# Altium project Control_Soldering iron.PrjPcb
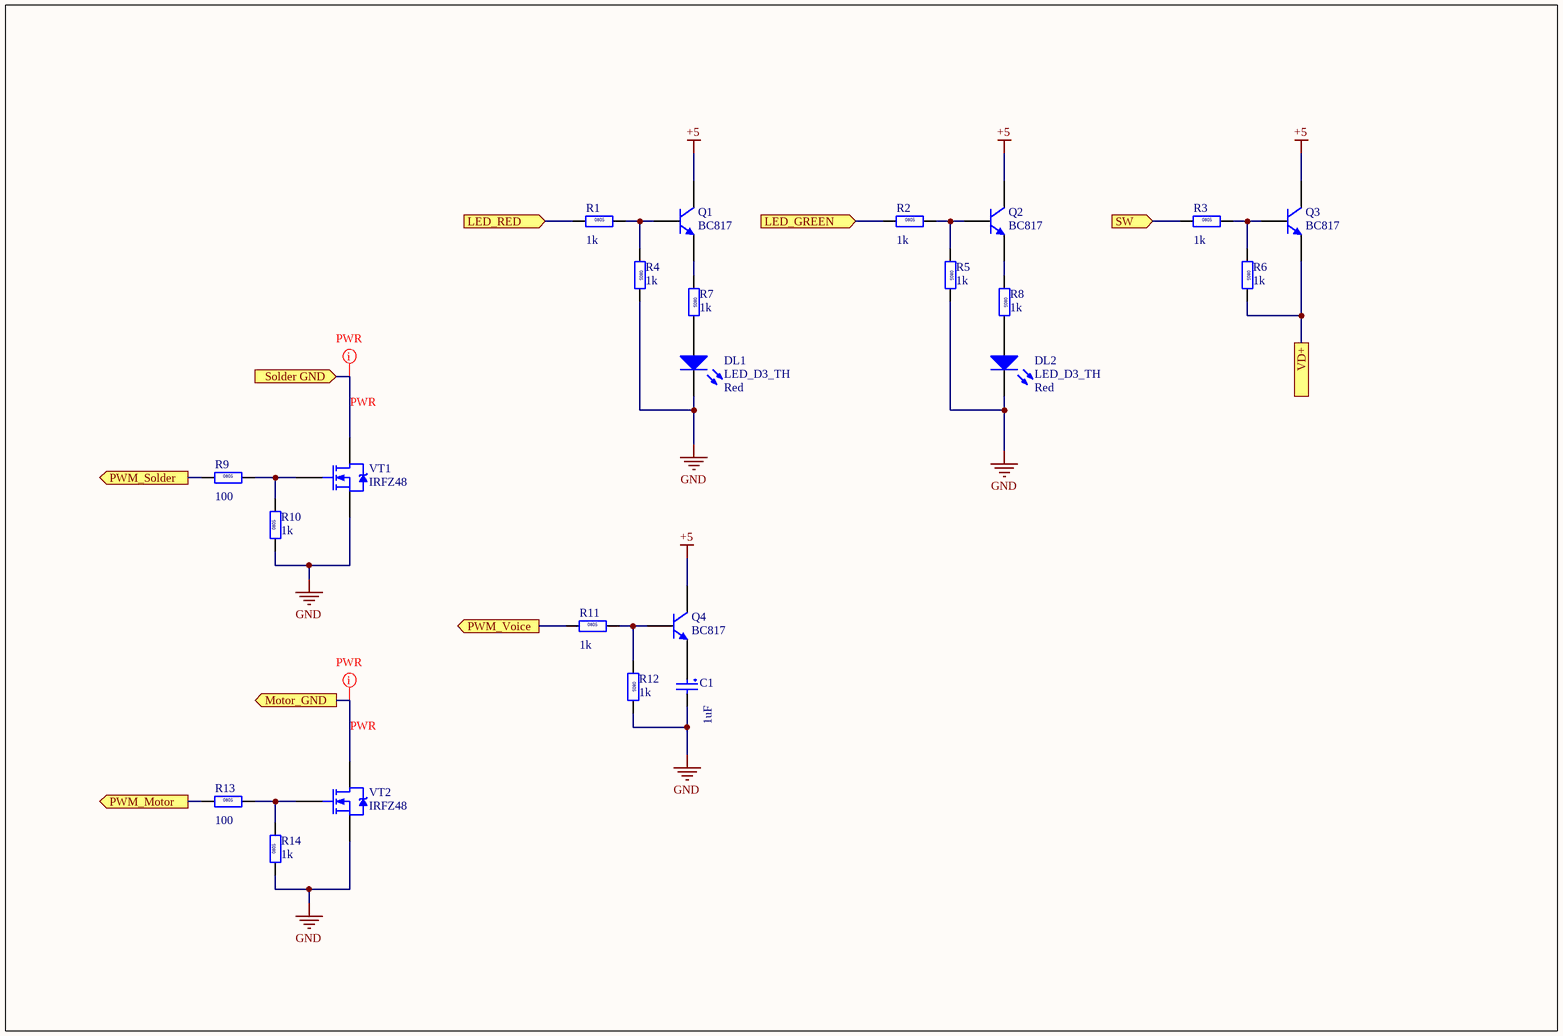
[diagram p0: Led_And_Sound.SchDoc]
2 sheets, 35 parts. Net scope: flat (ports and power ports of the same name join across sheets).
Board file: Soldering_Iron.PcbDoc
Sheets:
  Led_And_Sound.SchDoc
  Amplifier_For_Term.SchDoc

## Sheet Led_And_Sound.SchDoc
size A4

### Parts
C1  value 1uF  [ECAP1325]  (hidden comment: ECAP-1325)
DL1  LED_D3_TH  value Red  [LED_D3_TH]
DL2  LED_D3_TH  value Red  [LED_D3_TH]
Q1  BC817  [SOT23-3M]
Q2  BC817  [SOT23-3M]
Q3  BC817  [SOT23-3M]
Q4  BC817  [SOT23-3M]
R1  value 1k  [RESC2012-0805M]  (hidden comment: RESC_0805_R)
R2  value 1k  [RESC2012-0805M]  (hidden comment: RESC_0805_R)
R3  value 1k  [RESC2012-0805M]  (hidden comment: RESC_0805_R)
R4  value 1k  [RESC2012-0805M]  (hidden comment: RESC_0805_R)
R5  value 1k  [RESC2012-0805M]  (hidden comment: RESC_0805_R)
R6  value 1k  [RESC2012-0805M]  (hidden comment: RESC_0805_R)
R7  value 1k  [RESC2012-0805M]  (hidden comment: RESC_0805_R)
R8  value 1k  [RESC2012-0805M]  (hidden comment: RESC_0805_R)
R9  value 100  [RESC2012-0805M]  (hidden comment: RESC_0805_R)
R10  value 1k  [RESC2012-0805M]  (hidden comment: RESC_0805_R)
R11  value 1k  [RESC2012-0805M]  (hidden comment: RESC_0805_R)
R12  value 1k  [RESC2012-0805M]  (hidden comment: RESC_0805_R)
R13  value 100  [RESC2012-0805M]  (hidden comment: RESC_0805_R)
R14  value 1k  [RESC2012-0805M]  (hidden comment: RESC_0805_R)
VT1  IRFZ48  [TO-220]
VT2  IRFZ48  [TO-220]

### Ports
LED_GREEN (in), LED_RED (in), Motor_GND (out), PWM_Motor (out), PWM_Solder (out), PWM_Voice (out), Solder GND (in), SW (in), VD+

### Nets
+5: Q1.3(C) Q2.3(C) Q3.3(C) Q4.3(C)
GND: C1.2 DL1.2(K) DL2.2(K) R4.2 R5.2 R10.1 R12.2 R14.1 VT1.3(S) VT2.3(S)
NetC1_1: C1.1 Q4.2(E)
NetDL1_1: DL1.1(A) R7.2
NetDL2_1: DL2.1(A) R8.2
NetQ1_1: Q1.1(B) R1.2 R4.1
NetQ1_2: Q1.2(E) R7.1
NetQ2_1: Q2.1(B) R2.2 R5.1
NetQ2_2: Q2.2(E) R8.1
NetQ3_1: Q3.1(B) R3.2 R6.1
NetQ3_2: Q3.2(E) R6.2 ; port VD+
NetQ4_1: Q4.1(B) R11.2 R12.1
NetR1_1: R1.1 ; port LED_RED
NetR2_1: R2.1 ; port LED_GREEN
NetR3_1: R3.1 ; port SW
NetR9_1: R9.1 ; port PWM_Solder
NetR9_2: R9.2 R10.2 VT1.1(G)
NetR11_1: R11.1 ; port PWM_Voice
NetR13_1: R13.1 ; port PWM_Motor
NetR13_2: R13.2 R14.2 VT2.1(G)
NetVT1_2: VT1.2(D) ; port Solder GND
NetVT2_2: VT2.2(D) ; port Motor_GND

### Layout directives
mark named PWR: NetVT1_2, NetVT2_2

### Notes on the sheet
- PWR
- (in symbol RESC_0805_R) 0805

### Library data of the parts
C1 = ECAP-1325: Capacitor electrolytic 5 mm pitch, 13*25 body
DL1 DL2 = LED_D3_TH: LED Through hole D3mm
Q1-Q4 = BC817: BC817 NPN Transistor
R1-R14 = RESC_0805_R: Resistor 0805
VT1 VT2 = IRFZ48: HEXFET N-Channel Power MOSFET; Note: Pin 2 is electrically connected to pin 4.; Published: 8-Jun-2000; LatestRevisionDate: 17-Jul-2002; LatestRevisionNote: Re-released for DXP Platform.; DatasheetVersion: PD-9.758; PackageVersion: Feb-1997; PackageReference: TO-220AB; Publisher: Altium Limited; PackageDescription: TO, Thru-Hole, Vertical, Heatsink Mounted; 3 In-Line Leads; Pitch 2.54 mm; ComponentLink1Description: Manufacturer Link; ComponentLink1URL: http://www.irf.com/; ComponentLink2Description: Datasheet; ComponentLink2URL: http://www.irf.com/product-info/datasheets/data/irfz48.pdf

## Sheet Amplifier_For_Term.SchDoc
size A4
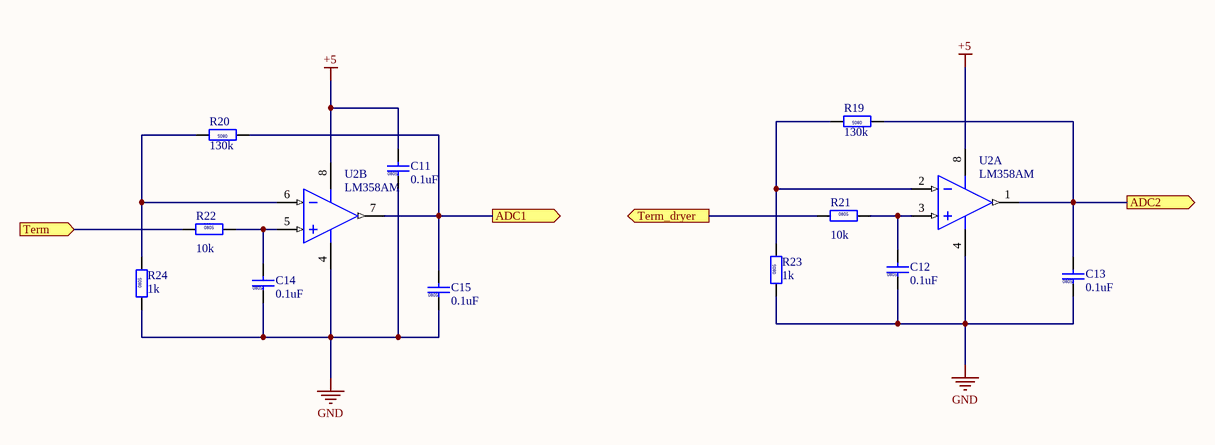
[diagram p1: Amplifier_For_Term.SchDoc]

### Parts
C11  value 0.1uF  [CAPC2012-0805M]  (hidden comment: CAPC_0805)
C12  value 0.1uF  [CAPC2012-0805M]  (hidden comment: CAPC_0805)
C13  value 0.1uF  [CAPC2012-0805M]  (hidden comment: CAPC_0805)
C14  value 0.1uF  [CAPC2012-0805M]  (hidden comment: CAPC_0805)
C15  value 0.1uF  [CAPC2012-0805M]  (hidden comment: CAPC_0805)
R19  value 130k  [RESC2012-0805M]  (hidden comment: RESC_0805_R)
R20  value 130k  [RESC2012-0805M]  (hidden comment: RESC_0805_R)
R21  value 10k  [RESC2012-0805M]  (hidden comment: RESC_0805_R)
R22  value 10k  [RESC2012-0805M]  (hidden comment: RESC_0805_R)
R23  value 1k  [RESC2012-0805M]  (hidden comment: RESC_0805_R)
R24  value 1k  [RESC2012-0805M]  (hidden comment: RESC_0805_R)
U2  LM358AM  [SO-8_L]  (parts A,B of 2)

### Ports
ADC1 (out), ADC2 (out), Term (in), Term_dryer (out)

### Nets
+5: C11.2 U2.8(V+)
GND: C11.1 C12.1 C13.1 C14.1 C15.1 R23.1 R24.1 U2.4(GND)
NetC12_2: C12.2 R21.2 U2.3(INA+)
NetC13_2: C13.2 R19.1 U2.1(OUTA) ; port ADC2
NetC14_2: C14.2 R22.2 U2.5(INB+)
NetC15_2: C15.2 R20.1 U2.7(OUTB) ; port ADC1
NetR19_2: R19.2 R23.2 U2.2(INA-)
NetR20_2: R20.2 R24.2 U2.6(INB-)
NetR21_1: R21.1 ; port Term_dryer
NetR22_1: R22.1 ; port Term

### Notes on the sheet
- (in symbol CAPC_0805) 0805
- (in symbol RESC_0805_R) 0805

### Library data of the parts
C11-C15 = CAPC_0805: Capacitor 0805
R19-R24 = RESC_0805_R: Resistor 0805
U2 = LM358AM: Low Power Dual Operational Amplifier; Manufacturer: National Semiconductor; CompType: Amplifiers; PackageTopMarking: NSZXTT*LM*358AM; PowerWise: N; Published: 4-Dec-2008; LatestRevisionDate: 13-Jan-2009; LatestRevisionNote: Sim Model Added.; DatasheetVersion: Oct-2005; PackageVersion: revL, Sep-2006; PackageReference: M08A; Publisher: Altium Limited; PackageDescription: SOIC Narrow, 4.9 x 3.9 x 1.45mm, 8 Lead, 1.27mm Pitch; PartNumber: LM358AM; RoHS: O; PinCount: 8; DigiKeyPartNumber: LM358AMXCT-ND; Code_JEDEC: MS-012-AA; Code_IPC: SOIC127P600-8; ComponentLink1Description: LM358 Datasheet; ComponentLink1URL: http://www.national.com/ds/LM/LM358.pdf; ComponentLink2Description: LM358 Web Page; ComponentLink2URL: http://www.national.com/pf/LM/LM358.html; ComponentLink3Description: M08A Package Page; ComponentLink3URL: http://www.national.com/packaging/folders/m08a.html

## Nets that join several sheets
+5: Led_And_Sound (Q1.3 Q2.3 Q3.3 Q4.3), Amplifier_For_Term (C11.2 U2.8)
GND: Led_And_Sound (10 pins), Amplifier_For_Term (8 pins)